# EAGLE design quadESP_Mark_2 (EAGLE 9.6.2)
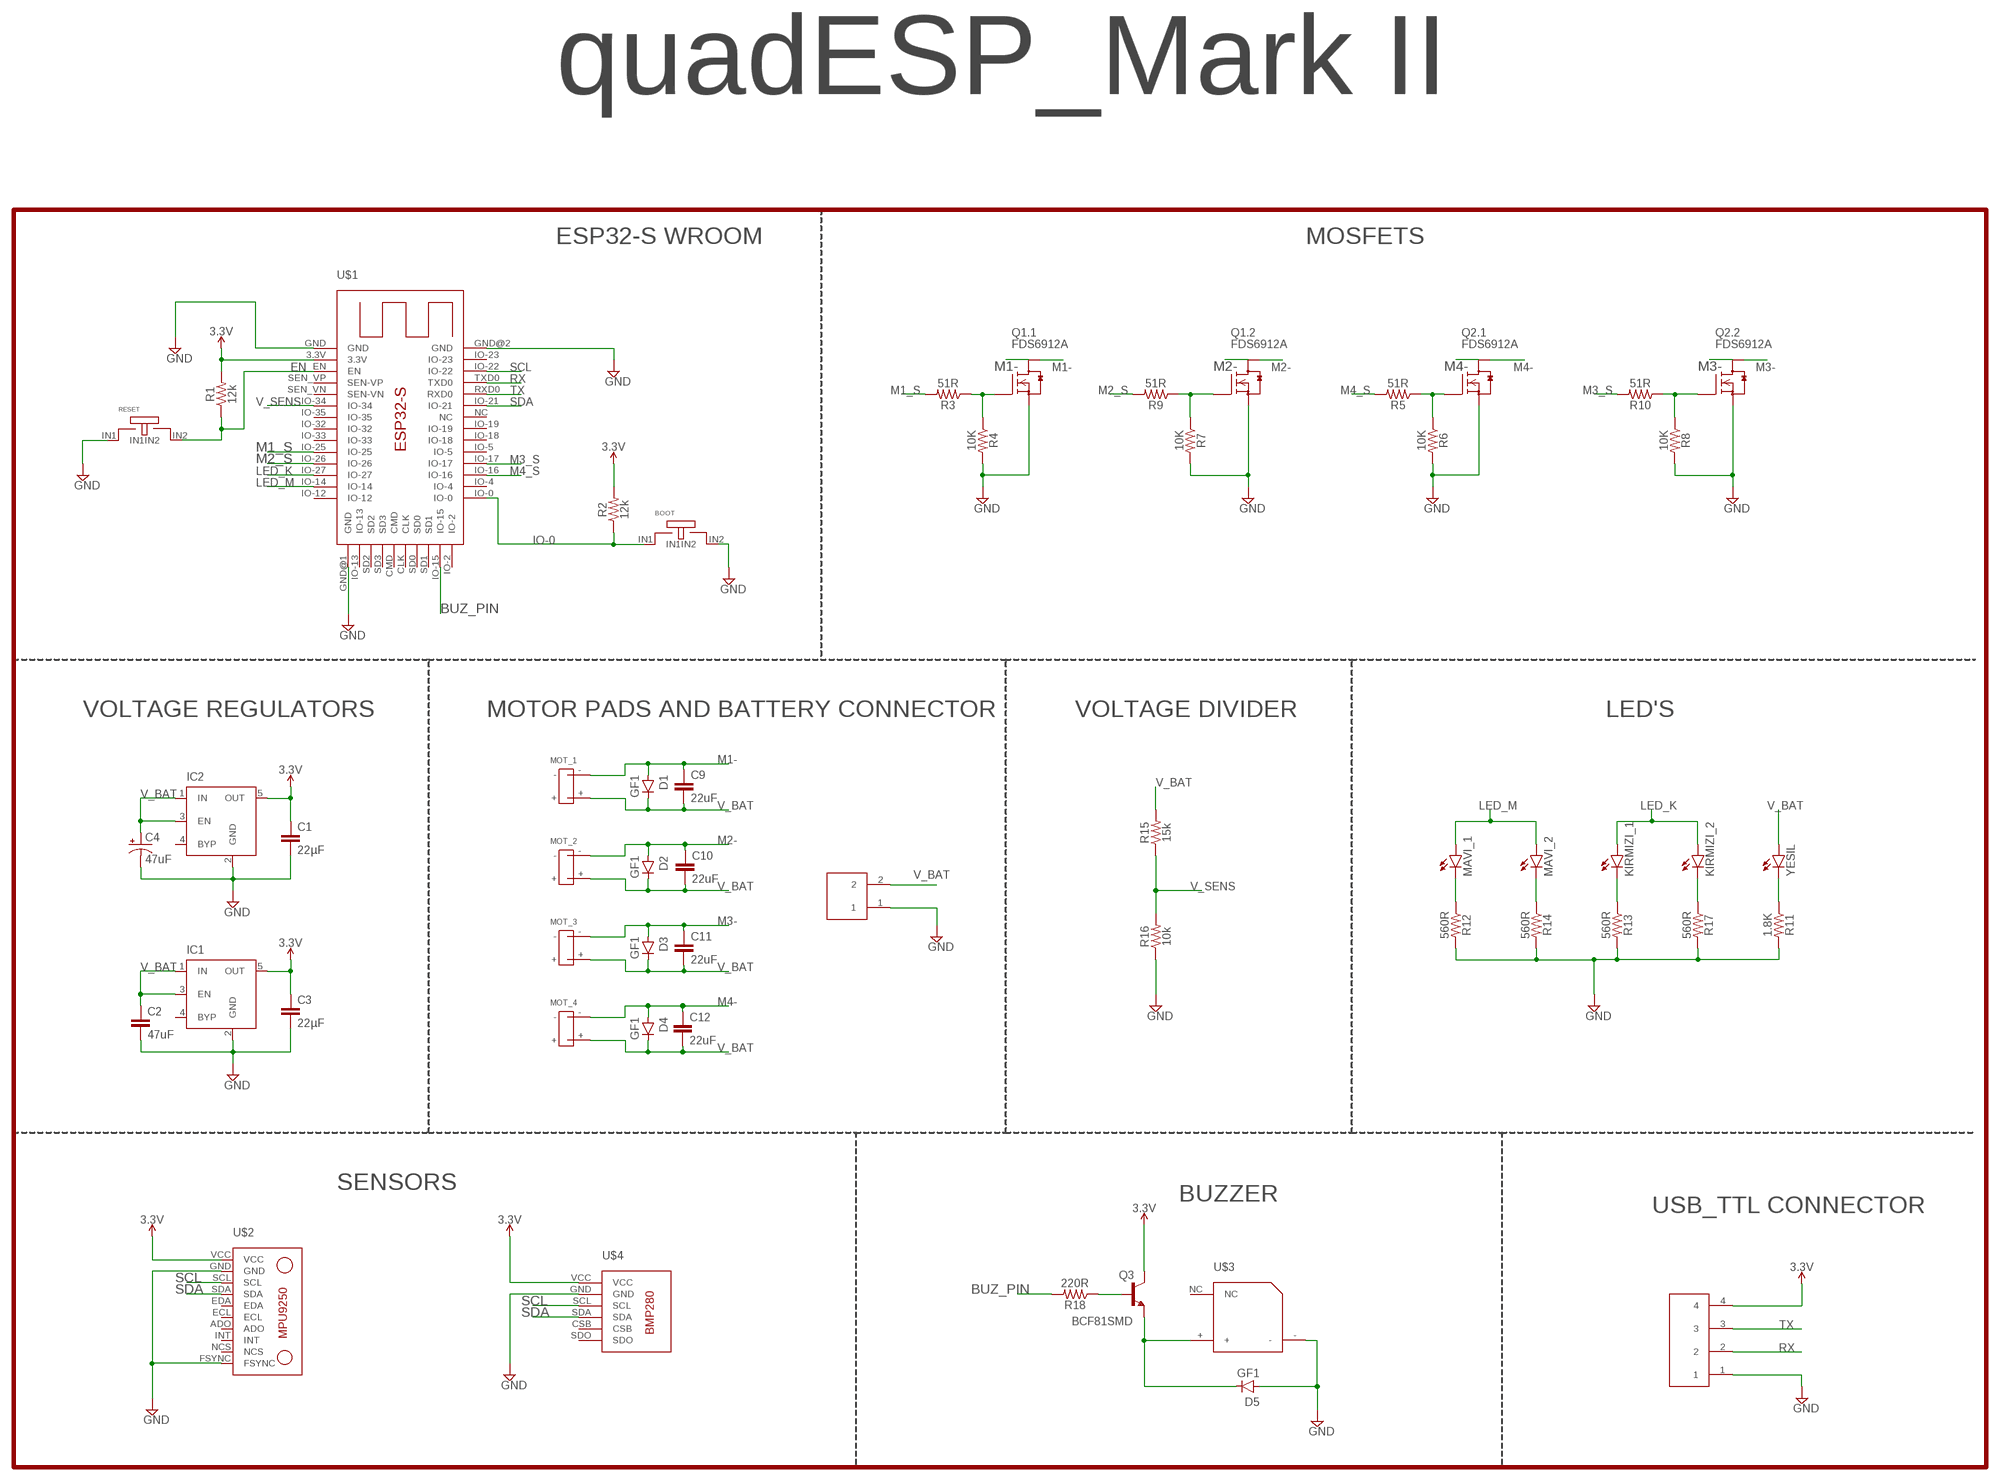
[diagram p0: schematic, sheet 1]

## Parts
BOOT  MINI_TIP_SMD_TACT_SWITCH_BUTON  [MINI_TIP_SMD_TACT_SWITCH_BUTON]
C1  22µF  0.33UF/330NF-0805-50V-10%  [0805]
C2  47uF  2.2UF-1206-50V-10%  [1206]
C3  22µF  0.33UF/330NF-0805-50V-10%  [0805]
C4  47uF  47UF-POLAR-EIA3528-10V-10%  [EIA3528]
C9  22uF  2.2UF-1206-50V-10%  [1206]
C10  22uF  2.2UF-1206-50V-10%  [1206]
C11  22uF  2.2UF-1206-50V-10%  [1206]
C12  22uF  2.2UF-1206-50V-10%  [1206]
D1  GF1  [SMA-DO214AC]
D2  GF1  [SMA-DO214AC]
D3  GF1  [SMA-DO214AC]
D4  GF1  [SMA-DO214AC]
D5  GF1  [SMA-DO214AC]
IC1  MIC5219XX  [SOT23-5]
IC2  MIC5219XX  [SOT23-5]
KIRMIZI_1  LEDCHIP-LED0805  [CHIP-LED0805]
KIRMIZI_2  LEDCHIP-LED0805  [CHIP-LED0805]
MAVI_1  LEDCHIP-LED0805  [CHIP-LED0805]
MAVI_2  LEDCHIP-LED0805  [CHIP-LED0805]
MOT_1  2X_SOLDER_PAD  [2X_SOLDER_PAD]
MOT_2  2X_SOLDER_PAD  [2X_SOLDER_PAD]
MOT_3  2X_SOLDER_PAD  [2X_SOLDER_PAD]
MOT_4  2X_SOLDER_PAD  [2X_SOLDER_PAD]
Q1  FDS6912A  [SO-8]
Q2  FDS6912A  [SO-8]
Q3  BCF81SMD  [SOT23-BEC]
R1  12k  0.3OHM-0805-1/8W-1%  [0805]
R2  12k  0.3OHM-0805-1/8W-1%  [0805]
R3  51R  0.3OHM-0805-1/8W-1%  [0805]
R4  10K  0.3OHM-0805-1/8W-1%  [0805]
R5  51R  0.3OHM-0805-1/8W-1%  [0805]
R6  10K  0.3OHM-0805-1/8W-1%  [0805]
R7  10K  0.3OHM-0805-1/8W-1%  [0805]
R8  10K  0.3OHM-0805-1/8W-1%  [0805]
R9  51R  0.3OHM-0805-1/8W-1%  [0805]
R10  51R  0.3OHM-0805-1/8W-1%  [0805]
R11  1.8K  0.3OHM-0805-1/8W-1%  [0805]
R12  560R  0.3OHM-0805-1/8W-1%  [0805]
R13  560R  0.3OHM-0805-1/8W-1%  [0805]
R14  560R  0.3OHM-0805-1/8W-1%  [0805]
R15  15k  0.3OHM-0805-1/8W-1%  [0805]
R16  10k  0.3OHM-0805-1/8W-1%  [0805]
R17  560R  0.3OHM-0805-1/8W-1%  [0805]
R18  220R  0.3OHM-0805-1/8W-1%  [0805]
RESET  MINI_TIP_SMD_TACT_SWITCH_BUTON  [MINI_TIP_SMD_TACT_SWITCH_BUTON]
U$1  ESP32-S  [ESP32-S]
U$2  MPU9250  [MPU9250]
U$3  PASIVE_BUZZER_5MM_X_5MM_20MM  [PASIVE_BUZZER_5MM_X_5MM_20MM]
U$4  BMP280  [BMP280]
U$5  2_PIN_TUNIC  [2_PIN_TUNIC]
U$6  4_PIN_TUNIC  [4_PIN_TUNIC]
YESIL  LEDCHIP-LED0805  [CHIP-LED0805]

## Nets
3.3V: C1.1 C3.1 IC1.5(OUT) IC2.5(OUT) Q3.C R1.2 R2.2 U$1.3.3V U$2.VCC U$4.VCC U$6.4
BUZ_PIN: R18.2 U$1.IO-15
EN: R1.1 RESET.IN2 U$1.EN
GND: BOOT.IN2 C1.2 C2.2 C3.2 C4.C(-) D5.A IC1.2(GND) IC2.2(GND) Q1.1(.2:S) Q1.3(.1:S) Q2.1(.2:S) Q2.3(.1:S) R4.2 R6.2 R7.2 R8.2 R11.2 R12.2 R13.2 R14.2 R16.1 R17.2 RESET.IN1 U$1.GND U$1.GND@1(GND) U$1.GND@2(GND) U$2.FSYNC U$2.GND U$3.- U$4.GND U$5.1 U$6.1
IO-0: BOOT.IN1 R2.1 U$1.IO-0
LED_K: KIRMIZI_1.A KIRMIZI_2.A U$1.IO-27
LED_M: MAVI_1.A MAVI_2.A U$1.IO-14
M1-: C9.1 D1.A MOT_1.- Q1.5(.1:D) Q1.6(.1:D)
M1_S: R3.2 U$1.IO-25
M2-: C10.1 D2.A MOT_2.- Q1.7(.2:D) Q1.8(.2:D)
M2_S: R9.2 U$1.IO-26
M3-: C11.1 D3.A MOT_3.- Q2.7(.2:D) Q2.8(.2:D)
M3_S: R10.2 U$1.IO-17
M4-: C12.1 D4.A MOT_4.- Q2.5(.1:D) Q2.6(.1:D)
M4_S: R5.2 U$1.IO-16
N$1: MAVI_2.C R14.1
N$2: KIRMIZI_1.C R13.1
N$3: KIRMIZI_2.C R17.1
N$4: R11.1 YESIL.C
N$5: MAVI_1.C R12.1
N$6: Q1.4(.1:G) R3.1 R4.1
N$7: Q1.2(.2:G) R7.1 R9.1
N$8: Q2.4(.1:G) R5.1 R6.1
N$9: Q2.2(.2:G) R8.1 R10.1
N$10: Q3.B R18.1
N$12: D5.K(C) Q3.E U$3.+
RX: U$1.TXD0 U$6.2
SCL: U$1.IO-22 U$2.SCL U$4.SCL
SDA: U$1.IO-21 U$2.SDA U$4.SDA
TX: U$1.RXD0 U$6.3
V_BAT: C2.1 C4.A(+) C9.2 C10.2 C11.2 C12.2 D1.K(C) D2.K(C) D3.K(C) D4.K(C) IC1.1(IN) IC1.3(EN) IC2.1(IN) IC2.3(EN) MOT_1.+ MOT_2.+ MOT_3.+ MOT_4.+ R15.2 U$5.2 YESIL.A
V_SENS: R15.1 R16.2 U$1.IO-34
Unconnected: IC1.4(BYP) IC2.4(BYP) U$1.CLK U$1.CMD U$1.IO-2 U$1.IO-4 U$1.IO-5 U$1.IO-12 U$1.IO-13 U$1.IO-18 U$1.IO-19 U$1.IO-23 U$1.IO-32 U$1.IO-33 U$1.IO-35 U$1.NC U$1.SD0 U$1.SD1 U$1.SD2 U$1.SD3 U$1.SEN_VN(SEN-VN) U$1.SEN_VP(SEN-VP) U$2.ADO U$2.ECL U$2.EDA U$2.INT U$2.NCS U$3.NC U$4.CSB U$4.SDO

## Notes on the sheet
- quadESP_Mark II
- ESP32-S WROOM | MOSFETS
- VOLTAGE REGULATORS | MOTOR PADS AND BATTERY CONNECTOR | VOLTAGE DIVIDER | LED'S
- SENSORS
- BUZZER
- USB_TTL CONNECTOR

## Library data of the parts
BOOT RESET = Tactile Switch 2 pin 6mm X 3mm:MINI_TIP_SMD_TACT_SWITCH_BUTON: 6 X 3mm smd switch
C1 C3 = SparkFun-Capacitors:0.33UF/330NF: 0.33µF/330nF ceramic capacitors A capacitor is a passive two-terminal electrical component used to store electrical energy temporarily in an electric field.; PROD_ID: CAP-08469; VALUE: 0.33µF
C2 C9-C12 = SparkFun-Capacitors:2.2UF: 2.2µF ceramic capacitors A capacitor is a passive two-terminal electrical component used to store electrical energy temporarily in an electric field.; PROD_ID: CAP-10009; VALUE: 2.2uF
C4 = SparkFun-Capacitors:47UF-POLAR: 47µF polarized capacitors A capacitor is a passive two-terminal electrical component used to store electrical energy temporarily in an electric field.; PROD_ID: CAP-08310
D1-D5 = diode:GF1: DIODE
IC1 IC2 = v-reg-micrel:MIC5219XX: VOLTAGE REGULATOR; OC_FARNELL: unknown; OC_NEWARK: unknown
KIRMIZI_1 KIRMIZI_2 MAVI_1 MAVI_2 YESIL = led:LED: LED OSRAM: - CHIPLED LG R971, LG N971, LY N971, LG Q971, LY Q971, LO R971, LY R971 LH N974, LH R974 LS Q976, LO Q976, LY Q976 LO Q996 - Hyper CHIPLED LW Q18S LB Q993, LB Q99A, LB R99A - SideLED LS A670, LO A670, LY A670, LG A670, LP A670 LB A673, LV A673, LT A673, LW A673 LH A674 LY A675 LS A676, LA A676, LO A676, LY A676, LW A676 LS A679, LY A679, LG A679 - Hyper Micro SIDELED® LS Y876, LA Y876, LO Y876, LY Y876 LT Y87S - SmartLED LW L88C, LW L88S LB L89C, LB L89S, LG L890 LS L89K, LO L89K, LY L89K LS L896, LA L896, LO L896, LY L896 - TOPLED LS T670, LO T670, LY T670, LG T670, LP T670 LSG T670, LSP T670, LSY T670, LOP T670, LYG T670 LG T671, LOG T671, LSG T671 LB T673, LV T673, LT T673, LW T673 LH T674 LS T676, LA T676, LO T676, LY T676, LB T676, LH T676, LSB T676, LW T676 LB T67C, LV T67C, LT T67C, LS T67K, LO T67K, LY T67K, LW E67C LS E67B, LA E67B, LO E67B, LY E67B, LB E67C, LV E67C, LT E67C LW T67C LS T679, LY T679, LG T679 LS T770, LO T770, LY T770, LG T770, LP T770 LB T773, LV T773, LT T773, LW T773 LH T774 LS E675, LA E675, LY E675, LS T675 LS T776, LA T776, LO T776, LY T776, LB T776 LHGB T686 LT T68C, LB T68C - Hyper Mini TOPLED® LB M676 - Mini TOPLED Santana® LG M470 LS M47K, LO M47K, LY M47K Source: http://www.osram.convergy.de LUXEON: - LUMILED® LXK2-PW12-R00, LXK2-PW12-S00, LXK2-PW14-U00, LXK2-PW14-V00 LXK2-PM12-R00, LXK2-PM12-S00, LXK2-PM14-U00 LXK2-PE12-Q00, LXK2-PE12-R00, LXK2-PE12-S00, LXK2-PE14-T00, LXK2-PE14-U00 LXK2-PB12-K00, LXK2-PB12-L00, LXK2-PB12-M00, LXK2-PB14-N00, LXK2-PB14-P00, LXK2-PB14-Q00 LXK2-PR12-L00, LXK2-PR12-M00, LXK2-PR14-Q00, LXK2-PR14-R00 LXK2-PD12-Q00, LXK2-PD12-R00, LXK2-PD12-S00 LXK2-PH12-R00, LXK2-PH12-S00 LXK2-PL12-P00, LXK2-PL12-Q00, LXK2-PL12-R00 Source: www.luxeon.com KINGBRIGHT: KA-3528ASYC Source: www.kingbright.com
MOT_1-MOT_4 = 2 X 3mm_round_solder_pads:2X_SOLDER_PAD
Q1 Q2 = m-pad-2.1:FDS6912A: Fairchild's FDS6912A Dual N-Channel Logic Level PowerTrench MOSFET General Description: These N-Channel Logic Level MOSFETs are produced using Fairchild Semiconductor's advanced PowerTrench process that has been especially tailored to minimize the on-state resistance and yet maintain superior switching performance. These devices are well suited for low voltage and battery powered applications where low in-line power loss and fast switching are required. Features: 6 A, 30 V. RDS(ON) = 28 mOhm @ VGS = 10 V RDS(ON) = 35 mOhm @ VGS = 4.5 V Fast switching speed Low gate charge High performance trench technology for extremely low RDS(ON) High power and current handling capability Please send any comments to: messi@users.sourceforge.net
Q3 = transistor-npn:BCF81*: NPN Transistor
R1-R18 = SparkFun-Resistors:0.3OHM: 0.3Ω resistor A resistor is a passive two-terminal electrical component that implements electrical resistance as a circuit element. Resistors act to reduce current flow, and, at the same time, act to lower voltage levels within circuits. - Wikipedia; PROD_ID: RES-11622; VALUE: 0.3
U$1 = ESP32-S:ESP32-S: ESP32-S WIFI/BLUETOOTH MICRO CONTROLLER IC size 18mm x 25.5mm pad size 1.5mm x 0.9mm
U$2 = MPU9250:MPU9250: MPU9250 9 DOF accelometer gyro compass sensor 15mm X 25mm
U$3 = PASIVE_BUZZER_5MM_X_5MM_20MM:PASIVE_BUZZER_5MM_X_5MM_20MM: PASIVE_BUZZER_5MM_X_5MM_20MM
U$4 = BMP280:BMP280: BMP280 Pressure sensor 11.5mm x 15mm
U$5 = Tunic_Connector:2_PIN_TUNIC
U$6 = Tunic_Connector:4_PIN_TUNIC

## Board
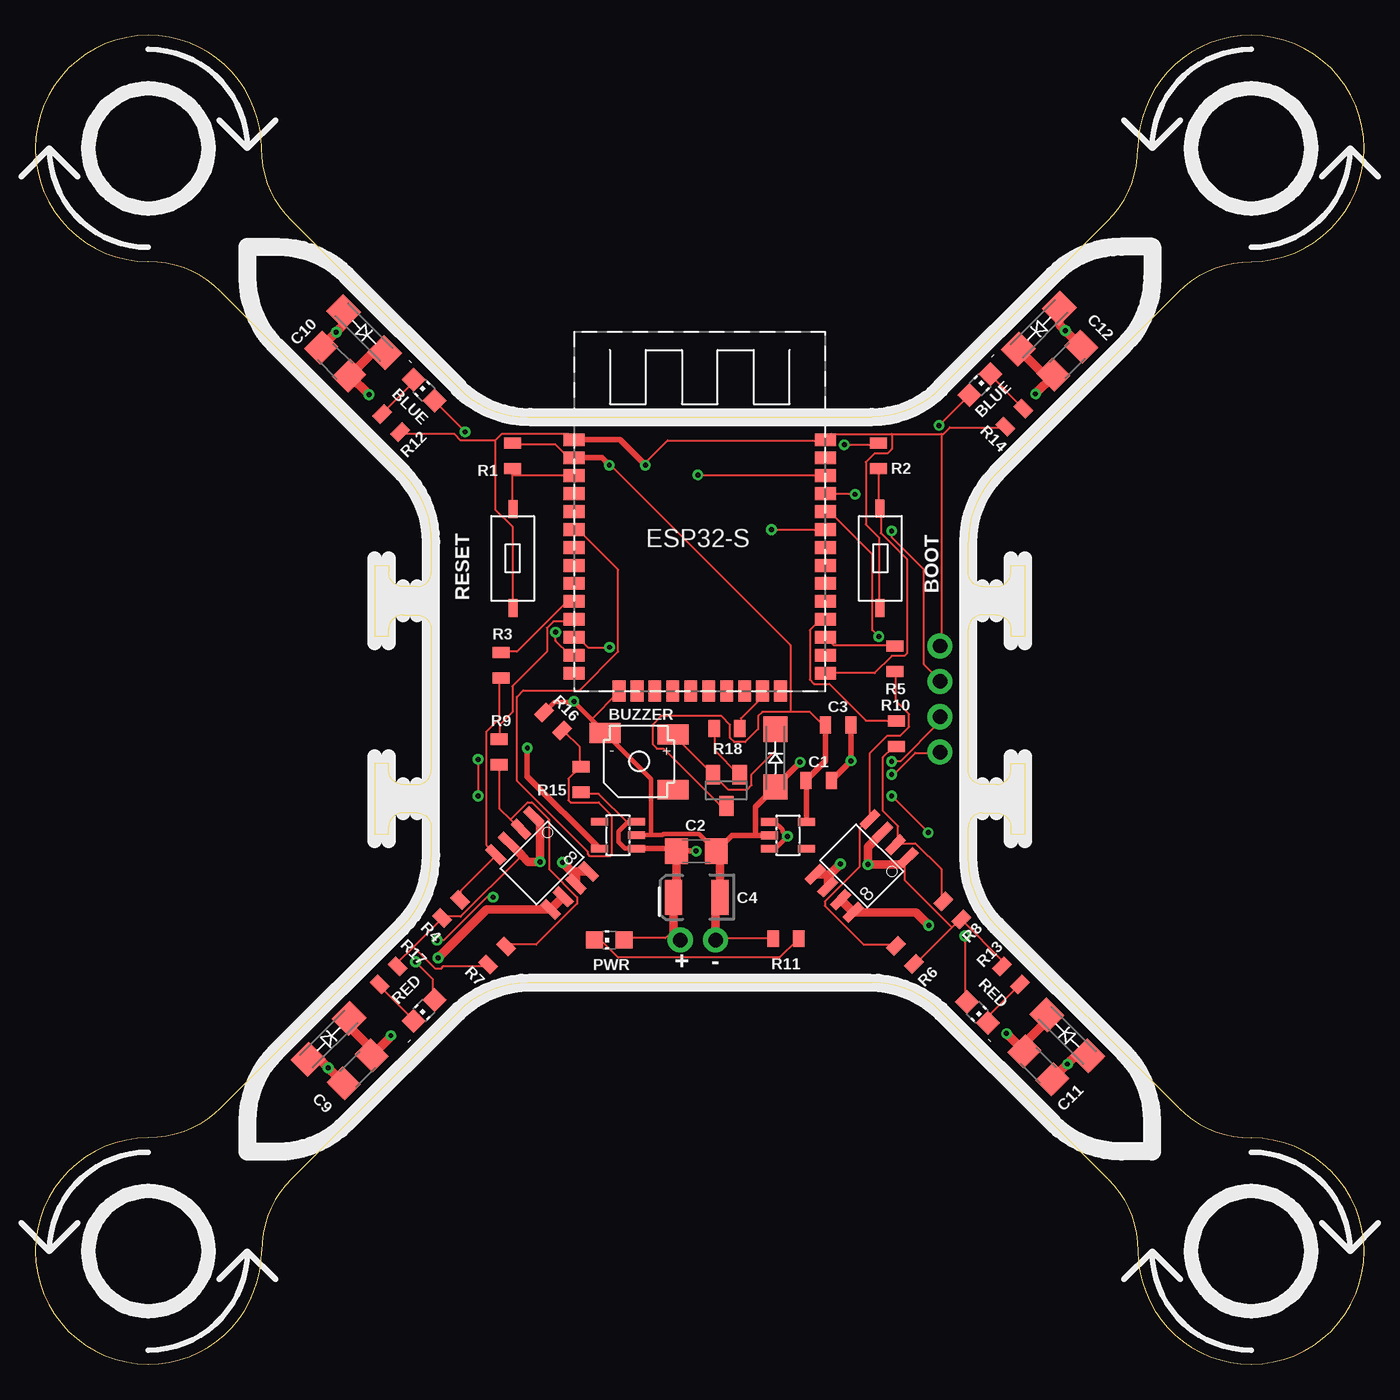
[diagram p1: board, top side]
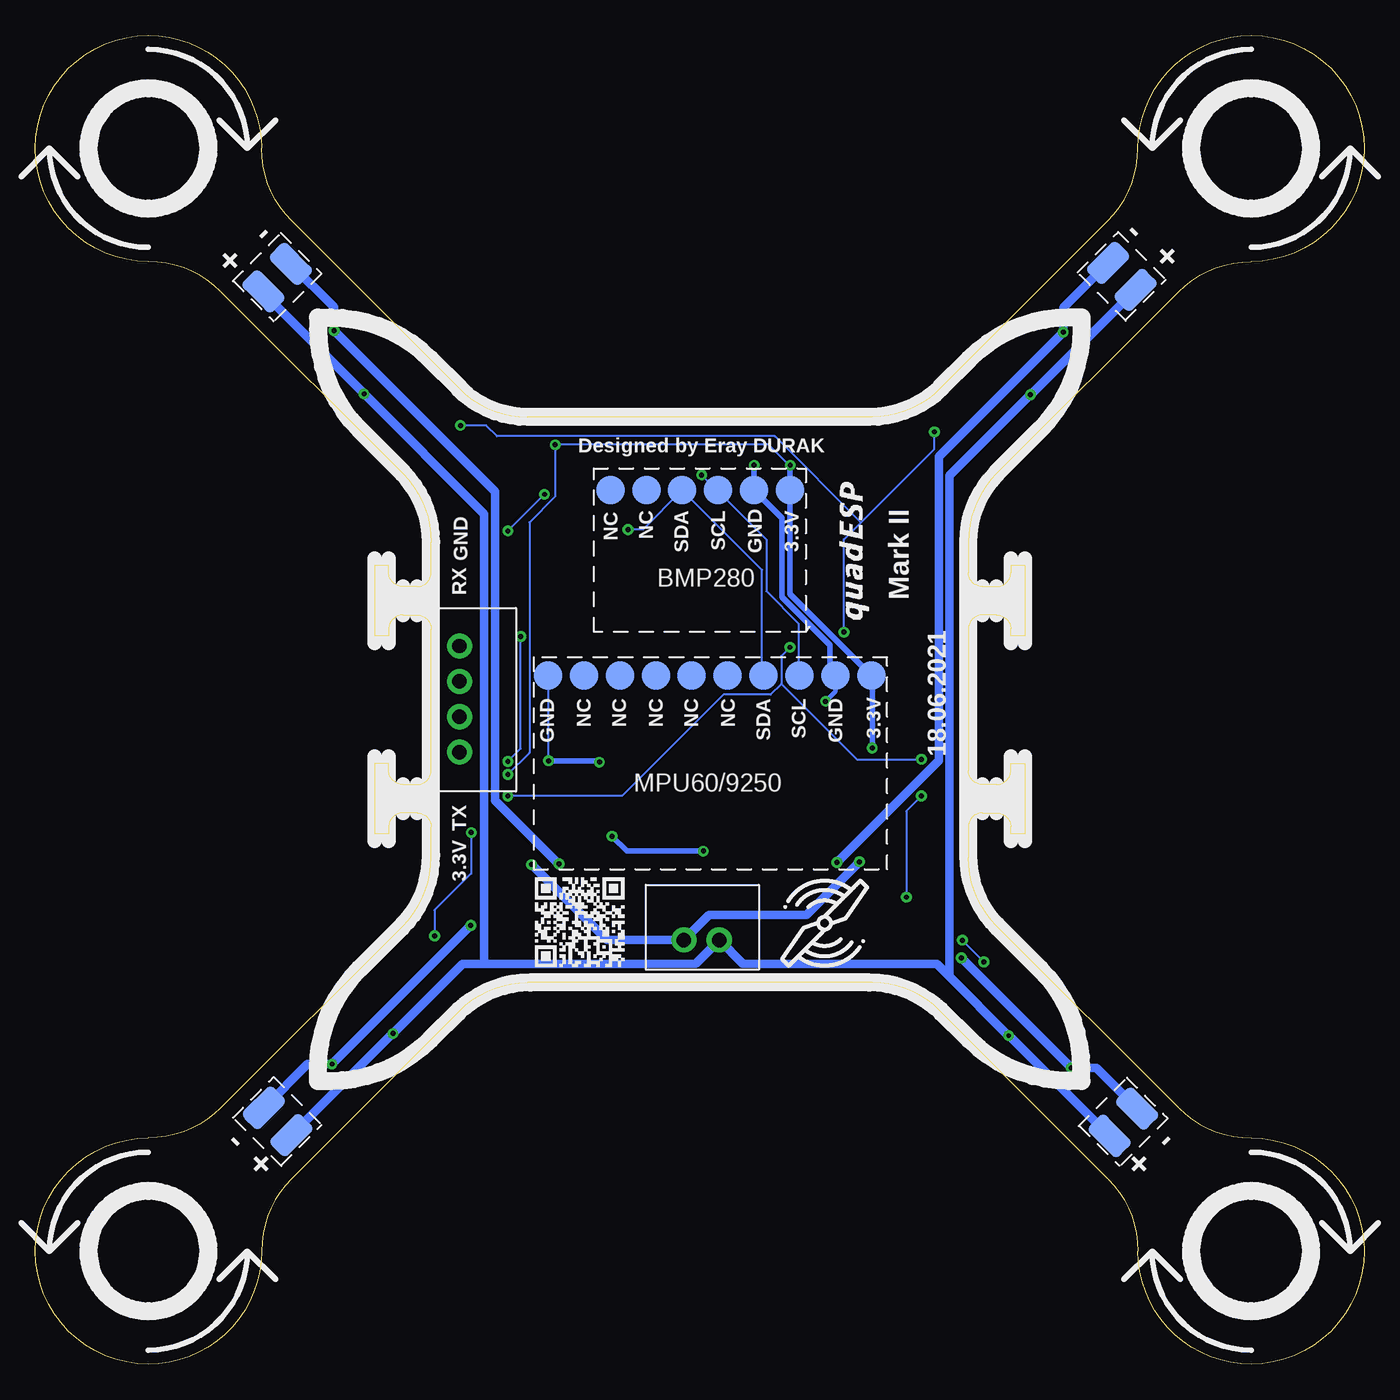
[diagram p2: board, bottom side, seen from below]

Size 94 x 94 mm. Coordinates in mm from the lower left corner, seen from the top.
Outline: 34.83,27 59.17,27 arc-45 64,25 75.88,13.12 arc-45 78,8 arc90 86,0 arc180 86,16 arc-45 80.88,18.12 68,31 arc-45 66,35.83 66,38 arc-90 67,39 68,39 arc-90 69,38 69,37.5 70,37.5 70,42.5 69,42.5 69,42 arc-90 68,41 67,41 arc-90 66,42 66,52 arc-90 67,53 68,53 arc-90 69,52 69,51.5 70,51.5 70,56.5 69,56.5 69,56 arc-90 68,55 67,55 arc-90 66,56 66,58.17 arc-45 68,63 80.88,75.88 arc-45 86,78 arc180 86,94 arc90 78,86 arc-45 75.88,80.88 64,69 arc-45 59.17,67 34.83,67 arc-45 30,69 18.12,80.88 arc-45 16,86 arc90 8,94 arc180 8,78 arc-45 13.12,75.88 26,63 arc-45 28,58.17 28,56 arc-90 27,55 26,55 arc-90 25,56 25,56.5 24,56.5 24,51.5 25,51.5 25,52 arc-90 26,53 27,53 arc-90 28,52 28,42 arc-90 27,41 26,41 arc-90 25,42 25,42.5 24,42.5 24,37.5 25,37.5 25,38 arc-90 26,39 27,39 arc-90 28,38 28,35.83 arc-45 26,31 13.12,18.12 arc-45 8,16 arc180 8,0 arc90 16,8 arc-45 18.12,13.12 30,25 arc-45 34.83,27
Copper layers (1*16): Top 0.035mm / dielectric 1.5mm / Bottom 0.035mm
Design rules "default": minimum track width 6mil, minimum drill 0.35mm, track to track 6mil, track to pad 6mil, pad to pad 6mil, via to via 6mil, smd to smd 6mil, copper to edge 40mil, drill to drill 6mil, minimum pad ring 10mil, minimum via ring 8mil, stop-mask expansion 4mil, vias tented up to drill 0mil, thermal gap 10mil
Holes 8.5 mm at 8,86 86,86 86,8 8,8

### Footprints (pad centres in the part's own frame; a part is rotated, then mirrored left to right if it is on the bottom)
MINI_TIP_SMD_TACT_SWITCH_BUTON = smd 1.27 x 0.635: IN1 -3.51,-0.53; IN2 3.5,-0.51
0805 = smd 0.8 x 1.2: 1 -0.9,0; 2 0.9,0
1206 = smd 1.6 x 1.8: 1 -1.4,0; 2 1.4,0
EIA3528 = smd 1.2 x 2.5: A 1.65,0; C -1.65,0
SMA-DO214AC = smd 1.8 x 1.7: A -2.05,0; K 2.05,0
SOT23-5 = smd 0.55 x 1.2: 1 -0.95,-1.3; 2 0,-1.3; 3 0.95,-1.3; 4 0.95,1.3; 5 -0.95,1.3
CHIP-LED0805 = smd 1.2 x 1.2: A 0,-1.05; C 0,1.05
2X_SOLDER_PAD = smd 3 x 1.7: + 0,-2; - 0,0.73
SO-8 = smd 1.524 x 0.61: 1 -2.743,1.27; 2 -2.743,0; 3 -2.743,-1.27; 4 -2.743,-2.54; 5 2.743,-2.54; 6 2.743,-1.27; 7 2.743,0; 8 2.743,1.27
SOT23-BEC = smd 1 x 1.4: B -0.95,-1.1; C 0,1.1; E 0.95,-1.1
ESP32-S = smd 1.5 x 0.9: 3.3V -8.89,7.62; EN -8.89,6.35; GND -8.89,8.89; GND@2 8.89,8.89; IO-0 8.89,-7.62; IO-4 8.89,-6.35; IO-5 8.89,-2.54; IO-12 -8.89,-7.62; IO-14 -8.89,-6.35; IO-16 8.89,-5.08; IO-17 8.89,-3.81; IO-18 8.89,-1.27; IO-19 8.89,0; IO-21 8.89,2.54; IO-22 8.89,6.35; IO-23 8.89,7.62; IO-25 -8.89,-2.54; IO-26 -8.89,-3.81; IO-27 -8.89,-5.08; IO-32 -8.89,0; IO-33 -8.89,-1.27; IO-34 -8.89,2.54; IO-35 -8.89,1.27; NC 8.89,1.27; RXD0 8.89,3.81; SEN_VN -8.89,3.81; SEN_VP -8.89,5.08; TXD0 8.89,5.08 | smd 0.9 x 1.5: CLK 0.635,-8.89; CMD -0.635,-8.89; GND@1 -5.715,-8.89; IO-2 5.715,-8.89; IO-13 -4.445,-8.89; IO-15 4.445,-8.89; SD0 1.905,-8.89; SD1 3.175,-8.89; SD2 -3.175,-8.89; SD3 -1.905,-8.89
MPU9250 = smd 2.032 x 2.032: ADO 1.27,8.89; ECL 1.27,11.43; EDA 1.27,13.97; FSYNC 1.27,1.27; GND 1.27,21.59; INT 1.27,6.35; NCS 1.27,3.81; SCL 1.27,19.05; SDA 1.27,16.51; VCC 1.27,24.13
PASIVE_BUZZER_5MM_X_5MM_20MM = smd 2.2 x 1.4: + -2.4,-1.9; - 2.4,-2; NC -2.4,2
BMP280 = smd 2.032 x 2.032: CSB -5.08,-2.54; GND -5.08,5.08; SCL -5.08,2.54; SDA -5.08,0; SDO -5.08,-5.08; VCC -5.08,7.62
2_PIN_TUNIC = drill 1.02 pad 1.778: 1 -1.3,0; 2 1.2,0
4_PIN_TUNIC = drill 1.02 pad 1.778: 1 -4,0; 2 -1.5,0; 3 1,0; 4 3.5,0

### Placement (x,y rotation side)
BOOT  60.27,57 270 top
C1  55.41,41.3 0 top
C2  46.76,36.29 0 top
C3  56.79,45.2 0 top
C4  46.79,33.02 180 top
C9  22.8,20.85 45 top
C10  21.19,70.93 315 top
C11  70.94,21.13 135 top
C12  73,71 225 top
D1  20.75,23 45 top
D2  23.25,73 315 top
D3  73,23.25 135 top
D4  71,73.25 225 top
D5  52.35,42.88 90 top
IC1  53.24,37.41 270 top
IC2  41.22,37.42 90 top
KIRMIZI_1  66.63,24.89 225 top
KIRMIZI_2  27.5,25.01 135 top
MAVI_1  27.5,68.89 45 top
MAVI_2  66.82,69.29 315 top
MOT_1  16.59,17.56 315 bottom
MOT_2  17.59,77.39 45 bottom
MOT_3  77.31,17.62 45 bottom
MOT_4  76.45,77.31 315 bottom
Q1  36.3,35.9 315 top
Q2  58.9,34.8 225 top
Q3  48.88,40.59 180 top
R1  33.75,64.25 90 top
R2  59.65,64.25 90 top
R3  32.93,49.44 90 top
R4  29.4,32.2 225 top
R5  60.8,49.9 90 top
R6  61.5,28.94 315 top
R7  32.67,28.93 225 top
R8  64.86,32.1 315 top
R9  32.8,43.3 90 top
R10  60.9,44.6 90 top
R11  53.1,30.1 180 top
R12  25.16,66.57 315 top
R13  69,27.5 135 top
R14  69.25,66.95 225 top
R15  38.6,41.36 270 top
R16  36.63,45.47 315 top
R17  25,27.5 45 top
R18  48.93,44.98 0 top
RESET  33.27,57 90 top
U$1  47,56.5 0 top
U$2  59,50 270 bottom
U$3  42.71,42.64 180 top
U$4  48.24,56.75 270 bottom
U$5  46.82,30.01 180 top
U$6  64,46.8 270 top
YESIL  40.6,30 90 top

### Tracks (layer width: path | path; a pad name or v marks a point on that pad's centre or on a via)
3.3V  (via drill 0.35)
  Top 0.152: 53.41,46.14 54.79,46.14 55.7,45.23 C3.1 | 53.41,46.14 51.43,46.14 51.13,45.84 51.13,44.92 50.21,44.01 49.45,44.01 49.15,44.31 49.15,45.23 48.54,45.84 44.27,45.84 43.66,45.23 43.66,43.85 43.97,43.55 44.42,43.55 48.39,39.59 48.84,39.59 Q3.C | R1.2 33.76,65.04 36.8,65.04 37.57,64.28 38.02,64.28 U$1.3.3V | v57.22,65.04 59.51,65.04 R2.2 | v60.58,41.72 60.73,41.72 62.25,43.24 63.93,43.24 U$6.4 | 53.41,46.14 53.41,50.86 40.77,63.51 v40.6,63.59
  Top 0.305: 54.54,41.27 C1.1
  Top 0.406: IC1.5 54.54,41.27 | IC2.5 34.8,41.59 v34.8,43.59 | 38.54,64.12 U$1.3.3V 40.07,64.12 v40.6,63.59 | C1.1 55.89,42.68 C3.1
  Bottom 0.152: v40.6,63.59 40.77,63.67 42.14,65.04 v57.22,65.04 57.22,61.38 59.05,59.55 59.05,43.24 v60.58,41.72
  Bottom 0.406: v34.8,43.59 34.8,48.66 U$2.VCC 40.62,54.48 U$4.VCC 40.62,63.57 v40.6,63.59
BUZ_PIN
  Top 0.152: R18.2 49.91,45.07 49.91,45.68 51.43,47.21 51.43,47.51 U$1.IO-15
EN
  Top 0.152: 33.76,62.9 33.76,60.62 RESET.IN2 | 33.76,62.9 33.76,63.21 R1.1 | 33.76,62.9 38.02,62.9 U$1.EN
GND  (via drill 0.35)
  Top 0.152: 60.58,65.8 56.31,65.8 56.01,65.5 U$1.GND@2 55.85,65.34 44.73,65.34 43.2,63.82 v43.15,63.59 | 60.58,65.8 64.08,65.8 | 64.08,65.8 64.24,65.8 64.69,66.26 68.5,66.26 R14.2 | 60.58,65.8 60.58,64.73 60.27,64.43 59.36,64.43 58.75,63.82 58.75,59.4 59.66,58.48 59.66,53.61 BOOT.IN2 | 64.08,65.8 64.08,50.86 U$6.1 | 26.75,29.53 28.73,31.51 R4.2 28.88,31.66 30.1,31.66 34.21,35.78 34.42,35.98 | 26.75,29.53 25.68,28.46 25.68,28.16 R17.2 | 26.75,29.53 28.27,28 28.73,28 28.88,28.16 31.93,28.16 R7.2 | 64.84,30.9 65.45,31.51 R8.2 65.61,31.36 68.35,28.61 68.35,28.16 R13.2 | 64.84,30.9 62.25,28.31 R6.2 | R11.2 52.2,30.14 48.39,30.14 U$5.1 | 32.54,65.34 30.1,65.34 29.64,65.8 25.83,65.8 R12.2 | 32.54,65.34 32.99,65.8 37.72,65.8 38.02,65.5 U$1.GND | 32.54,65.34 32.54,60.47 33.76,59.25 33.76,53.61 RESET.IN1 | 39.33,45.62 41.22,47.51 U$1.GND@1 | 64.84,30.9 61.49,34.25 61.49,35.17 Q2.1
  Top 0.305: 43.55,37.42 44.36,37.42 44.43,37.49 46.95,37.49 C2.2 | 43.55,37.42 IC2.2 | 43.55,37.42 43.55,41.4 U$3.- 39.33,45.62 38.1,46.85 | 38.1,46.85 v38.1,46.89 | R16.1 36.74,46.85 38.1,46.85
  Top 0.406: C2.2 49.28,37.41 50.95,37.41 | 50.95,37.41 IC1.2 | 50.95,37.41 50.95,39.43 D5.A v54.1,42.58 v54.1,42.59 | C3.2 v57.69,42.68 C1.2 | v43.15,63.59 41.35,65.39 U$1.GND
  Top 0.61: Q1.3 34.42,35.98 34.86,35.54 v35.7,35.54 35.7,38.3 Q1.1 | Q2.3 58.9,36.6 v58.9,35.34 61.24,35.34 Q2.1 | U$5.1 48.12,32.7 C4.C 48.44,36.01 C2.2
  Bottom 0.152: U$2.FSYNC 57.68,48.58 57.68,42.79 v57.69,42.68
  Bottom 0.305: v38.1,46.89 37.41,47.58 U$2.GND
  Bottom 0.406: U$2.GND 37.8,49.12 37.8,50.87 41.18,54.25 41.18,59.85 U$4.GND v43.16,63.58 v43.15,63.59 | v57.69,42.68 54.19,42.68 v54.1,42.59
  Bottom 0.61: v35.7,35.54 39.45,31.79 46.33,31.79 U$5.1 53.56,30.01 v58.9,35.34
IO-0
  Top 0.152: R2.1 59.66,63.21 59.66,60.62 BOOT.IN1 59.82,60.47 59.82,58.79 61.64,56.96 61.64,50.26 61.49,50.1 60.58,50.1 59.36,48.88 56.01,48.88 U$1.IO-0
LED_K  (via drill 0.35)
  Top 0.152: v65.76,30.29 65.76,25.72 KIRMIZI_1.A | v60.58,40.2 v63.17,37.61 | v40.61,50.71 39.09,50.71 38.48,51.32 38.17,51.32 U$1.IO-27 | v26.9,28.46 28.12,27.24 28.12,25.87 KIRMIZI_2.A | v28.42,29.99 28.88,29.99 31.93,33.03 v32.38,33.03 | v31.32,42.79 v31.32,40.2
  Bottom 0.152: v65.76,30.29 65.76,32.12 63.17,34.71 v63.17,37.61 | v60.58,40.2 52.5,40.2 45.34,47.36 41.98,47.36 41.22,48.12 | 41.22,48.12 41.22,50.1 v40.61,50.71 | v28.42,29.99 v26.9,28.46 | v32.38,33.03 32.38,39.13 v31.32,40.2 | v31.32,42.79 35.89,42.79 41.22,48.12
LED_M  (via drill 0.35)
  Top 0.152: v30.4,65.95 28.27,68.09 MAVI_1.A | v36.8,51.78 36.8,51.17 37.72,50.26 38.02,50.26 U$1.IO-14 | v63.93,66.41 66.06,68.54 MAVI_2.A
  Bottom 0.152: v30.4,65.95 30.4,64.73 35.58,59.55 | 35.58,59.55 36.8,58.33 v36.8,51.78 | v63.93,66.41 62.1,66.41 61.34,65.65 41.68,65.65 35.58,59.55
M1-  (via drill 0.35)
  Top 0.61: D1.A 20.12,21.55 v20.71,20.95 C9.1 | v28.49,28.74 31.91,32.16 Q1.5 Q1.6
  Bottom 0.61: MOT_1.- 18.95,20.95 v20.71,20.95 v28.49,28.73 v28.49,28.74
M1_S
  Top 0.152: R3.2 32.99,50.41 34.06,50.41 37.57,53.91 38.02,53.91 U$1.IO-25
M2-  (via drill 0.35)
  Top 0.61: D2.A 21.8,73.52 v21.29,73 C10.1 | v37.3,35.49 37.93,34.86 | 37.93,34.86 38.24,34.55 Q1.7 | Q1.8 37.93,34.86
  Bottom 0.61: MOT_2.- 21.29,74.73 v21.29,73 30.09,64.2 30.09,42.7 v37.3,35.49
M2_S
  Top 0.152: R9.2 32.84,44.31 32.84,45.23 33.76,46.14 33.76,47.97 36.19,50.41 36.19,52.08 36.65,52.54 38.02,52.54 U$1.IO-26
M3-  (via drill 0.35)
  Top 0.61: D3.A 73.59,21.8 v73.01,21.23 C11.1 | v63.2,31.04 62.28,31.96 Q2.8 Q2.7
  Bottom 0.61: MOT_3.- 74.74,21.23 v73.01,21.23 v63.2,31.04 | v63.2,31.04
M3_S
  Top 0.152: R10.2 60.88,45.53 58.75,45.53 56.16,48.12 55.09,48.12 54.79,48.43 54.79,51.93 55.4,52.54 55.85,52.54 U$1.IO-17
M4-  (via drill 0.35)
  Top 0.61: D4.A 72.45,73.53 v72.87,73.11 C12.1 | Q2.6 56.06,34.5 v56.95,35.39 56.22,34.66 Q2.5
  Bottom 0.61: MOT_4.- 72.87,74.77 v72.87,73.11 61.49,61.73 61.49,39.89 56.99,35.39 v56.95,35.39
M4_S
  Top 0.152: R5.2 60.73,50.86 56.46,50.86 56.01,51.32 U$1.IO-16
N$1
  Top 0.152: MAVI_2.C 67.59,69.91 69.87,67.63 R14.1
N$2
  Top 0.152: KIRMIZI_1.C 67.44,24.19 67.44,24.65 69.57,26.79 R13.1
N$3
  Top 0.152: KIRMIZI_2.C 26.75,24.35 24.31,26.79 R17.1
N$4
  Top 0.152: YESIL.C 39.7,29.99 40,29.99 41.22,28.77 52.65,28.77 53.87,29.99 R11.1
N$5
  Top 0.152: R12.1 24.61,67.32 26.9,69.61 MAVI_1.C
N$6
  Top 0.152: R4.1 30.1,32.88 30.1,33.49 32.54,35.93 Q1.4 32.54,36.08 31.93,36.69 31.93,44.77 32.84,45.68 32.84,48.43 R3.1
N$7
  Top 0.152: 33.6,38.52 34.21,37.91 Q1.2 | 33.6,38.52 32.84,39.28 32.84,42.33 R9.1 | 33.6,38.52 34.82,39.74 35.13,39.74 36.35,38.52 36.35,35.02 38.33,33.03 38.33,32.58 35.43,29.68 33.45,29.68 R7.1
N$8
  Top 0.152: R5.1 60.88,48.88 60.88,46.9 61.8,45.99 61.8,45.07 61.19,44.46 60.27,44.46 59.05,43.24 59.05,38.67 Q2.4 58.9,38.52 58.29,37.91 58.29,35.17 55.85,32.73 55.85,32.42 58.6,29.68 60.73,29.68 R6.1
N$9
  Top 0.152: 61.03,36.84 60.88,36.84 Q2.2 61.03,36.84 | 61.03,36.84 62.25,36.84 64.08,35.02 64.08,32.88 R8.1 | 61.03,36.84 61.03,38.06 59.97,39.13 59.97,42.94 60.58,43.55 60.88,43.55 R10.1
N$10
  Top 0.152: R18.1 48.08,44.92 48.08,43.4 49.76,41.72 Q3.B
N$12
  Top 0.152: U$3.+ 45.19,44.46 47.93,41.72 Q3.E 48.08,41.57 49,40.65 50.37,40.65 50.67,40.96 50.67,41.72 52.35,43.4 D5.K
RX  (via drill 0.35)
  Top 0.152: v57.99,61.53 56.01,61.53 U$1.TXD0 | v60.58,58.94 60.58,58.48 62.86,56.2 62.86,49.49 63.93,48.43 U$6.2
  Bottom 0.152: v60.58,58.94 v57.99,61.53
SCL  (via drill 0.35)
  Top 0.152: v46.86,62.9 55.85,62.9 U$1.IO-22
  Bottom 0.152: v46.86,62.9 45.79,61.84 U$4.SCL 45.64,61.69 42.29,58.33 42.29,54.67 40,52.39 40,48.73 U$2.SCL
SDA  (via drill 0.35)
  Top 0.152: v52.08,59.04 U$1.IO-21
  Bottom 0.152: 48.39,61.69 U$4.SDA | U$2.SDA 42.59,48.73 42.59,56.19 U$4.SDA | U$4.SDA 51.03,59.04 v52.08,59.04
TX  (via drill 0.35)
  Top 0.152: v59.66,51.47 59.21,51.93 59.21,57.27 56.31,60.16 56.01,60.16 U$1.RXD0 | v60.58,42.64 61.19,42.64 63.93,45.38 63.93,45.68 U$6.3
  Bottom 0.152: v59.66,51.47 59.66,43.55 v60.58,42.64
V_BAT  (via drill 0.35)
  Top 0.152: YESIL.A 41.68,30.14 44.58,30.14 44.88,30.44 U$5.2 | 41.88,38.32 39.85,40.35 38.63,40.35 R15.2
  Top 0.305: C2.1 45.18,36.47 | IC2.1 41.72,36.47 41.25,36.94 41.25,37.69 41.88,38.32 41.93,38.37 IC2.3 | IC1.3 52.32,36.46 v53.2,37.34 52.84,37.7 52.84,37.81 52.3,38.36 IC1.1
  Top 0.406: 45.18,36.47 IC2.1 | C2.1 v46.75,36.29
  Top 0.61: v25.15,23.24 25.15,23.2 24.02,22.07 | 24.02,22.07 C9.2 | D1.K 22.2,23.89 24.02,22.07 | v68.7,23.39 69.67,22.41 | 69.67,22.41 69.95,22.14 C11.2 | D3.K 71.55,24.29 69.67,22.41 | v23.6,68.59 22.25,69.94 | 22.25,69.94 C10.2 | D2.K 23.86,71.55 22.25,69.94 | v70.75,68.64 72.01,69.9 | 72.01,69.9 C12.2 | D4.K 71.45,69.9 72.01,69.9 | U$5.2 45.14,30.48 C4.A 45.36,33.24 C2.1
  Bottom 0.406: v46.75,36.29 52.15,36.29 v53.2,37.34
  Bottom 0.61: MOT_1.+ 25.1,23.24 v25.15,23.24 29.32,27.41 | 29.32,27.41 30.23,28.32 43.93,28.32 U$5.2 47.3,28.32 62.25,28.32 | MOT_3.+ 68.71,23.39 v68.7,23.39 63.77,28.32 62.25,28.32 | MOT_2.+ 23.56,68.59 v23.6,68.59 29.32,62.87 29.32,27.41 | MOT_4.+ 77.86,75.75 v70.75,68.64 62.25,60.14 62.25,28.32
V_SENS
  Top 0.152: R16.2 37.41,44.77 38.48,43.7 38.48,42.33 R15.1 38.48,42.18 37.72,41.42 37.72,39.89 37.87,39.74 39.85,39.74 40.77,38.83 40.77,36.08 40.61,35.93 39.24,35.93 39.09,36.08 39.09,36.23 34.06,41.26 34.06,47.21 34.52,47.66 38.48,47.66 41.22,50.41 41.22,56.2 38.48,58.94 38.17,58.94 U$1.IO-34

### Text on the board
tPlace: - | - | BLUE | BLUE | RESET | BOOT | BUZZER | - | + | PWR | + | - | RED | RED | - | -
bPlace: - | - | + | + | Designed by Eray DURAK | Mark II | GND | 3.3V | SCL | SDA | NC | NC | GND | RX | 18.06.2021 | 3.3V | GND | SCL | SDA | NC | NC | NC | NC | NC | GND | TX | 3.3V | - | - | + | +